# EAGLE design KLine_bottom_board (EAGLE 6.1)
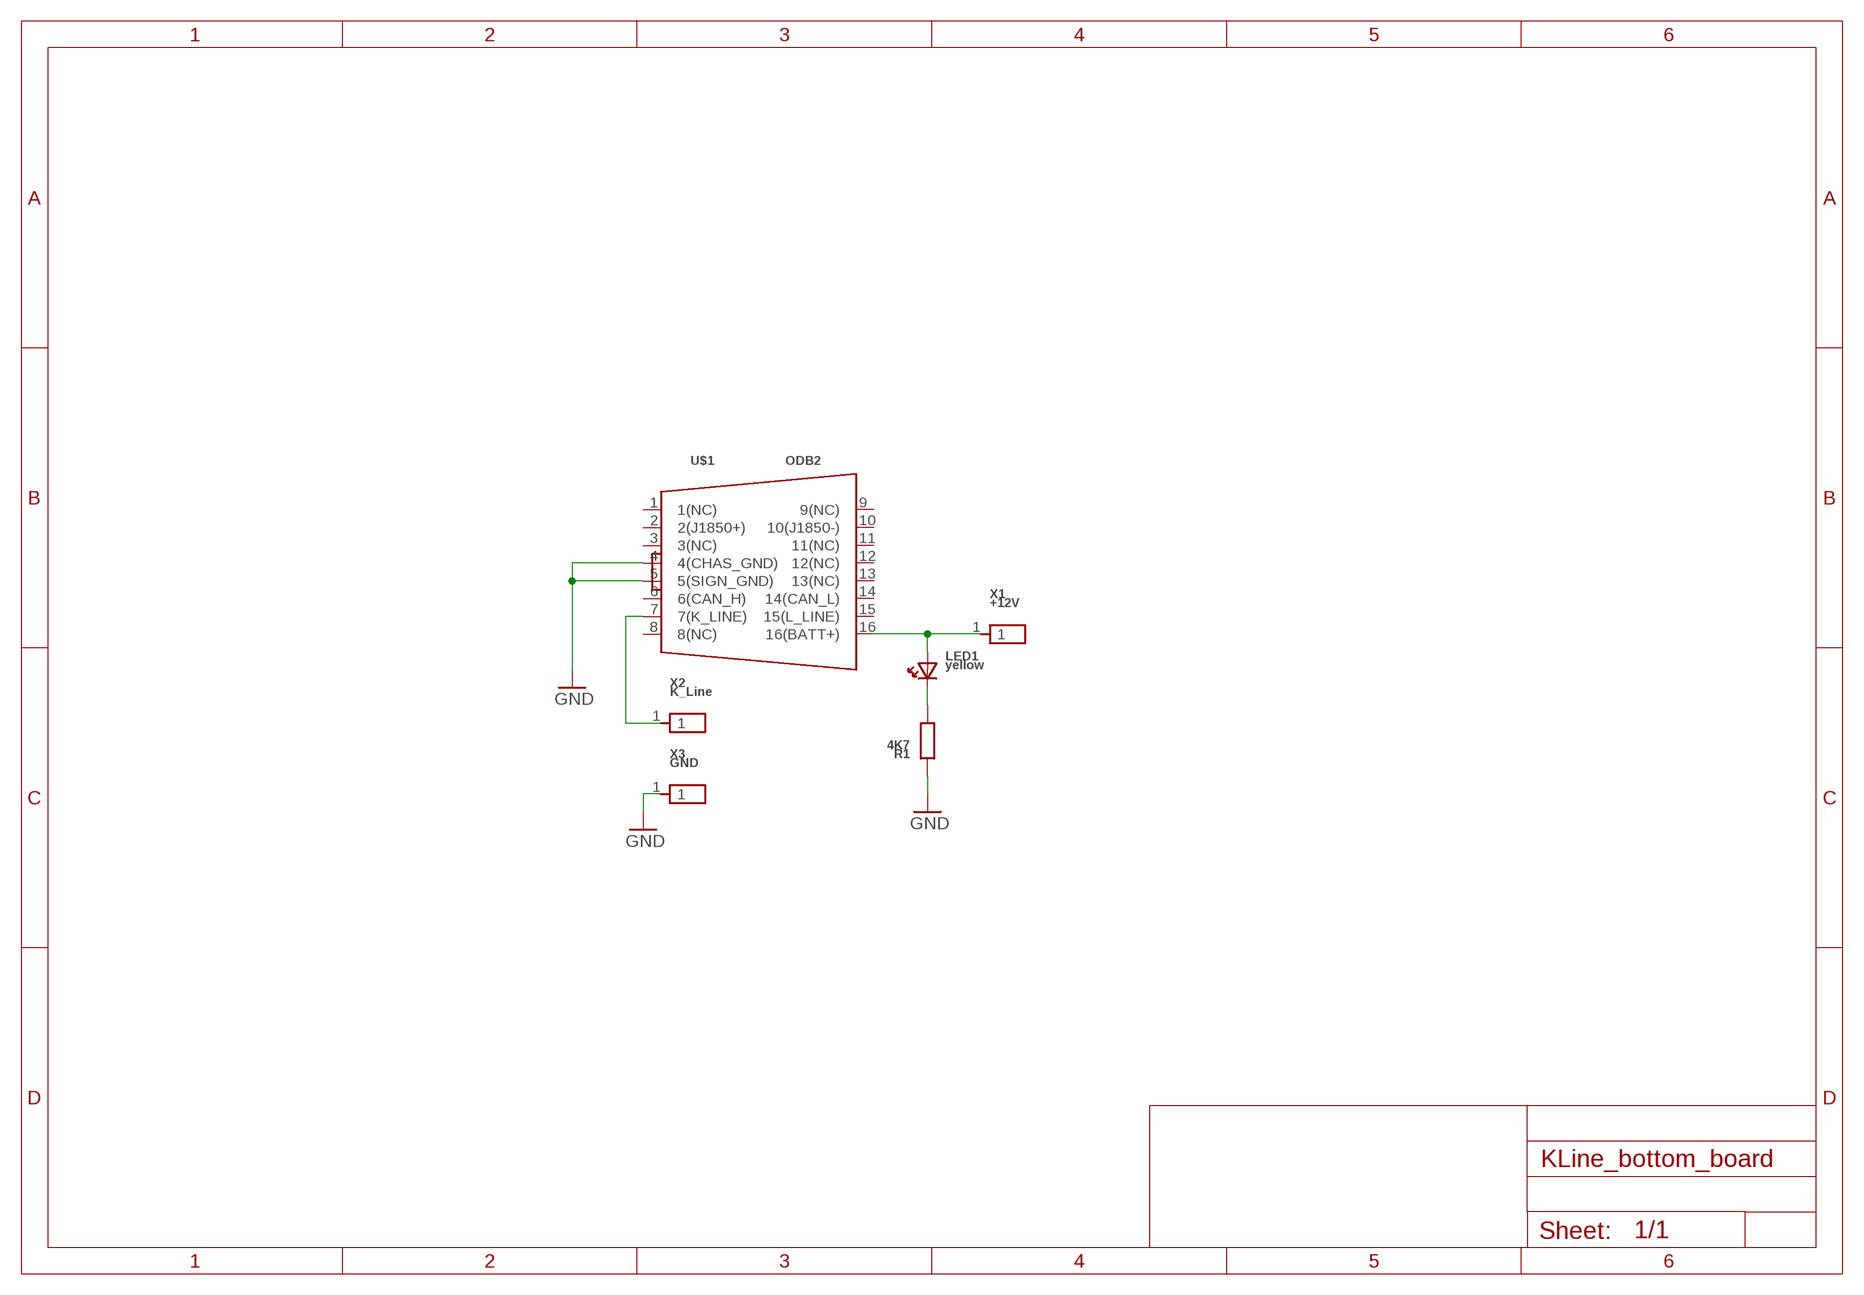
[diagram p0: schematic, sheet 1]

## Parts
LED1  yellow  LED3MM(SMD0805)  [LED_0805]
R1  4K7  RSMD_0805  [RSMD_0805]
U$1  ODB2  [ODB2]
X1  +12V  PIN1X13.5MM_SIDE_BOARD  [PIN1X1_3.5MM_SIDE_BOARD]
X2  K_Line  PIN1X13.5MM_SIDE_BOARD  [PIN1X1_3.5MM_SIDE_BOARD]
X3  GND  PIN1X13.5MM_SIDE_BOARD  [PIN1X1_3.5MM_SIDE_BOARD]

## Nets
BAT_+12V: LED1.ANODE U$1.16(16(BATT+)) X1.1
GND: R1.PAD_1(PIN1) U$1.4(4(CHAS_GND)) U$1.5(5(SIGN_GND)) X3.1
N$2: U$1.7(7(K_LINE)) X2.1
N$3: LED1.CATHODE R1.PAD_0(PIN0)
Unconnected: U$1.1(1(NC)) U$1.2(2(J1850+)) U$1.3(3(NC)) U$1.6(6(CAN_H)) U$1.8(8(NC)) U$1.9(9(NC)) U$1.10(10(J1850-)) U$1.11(11(NC)) U$1.12(12(NC)) U$1.13(13(NC)) U$1.14(14(CAN_L)) U$1.15(15(L_LINE))

## Library data of the parts
LED1 = __MyCommonLib1:LED3MM
R1 = __MyCommonLib1:R
U$1 = __MyCommonLib1:ODB2
X1-X3 = __MyCommonLib1:PIN1X1

## Board
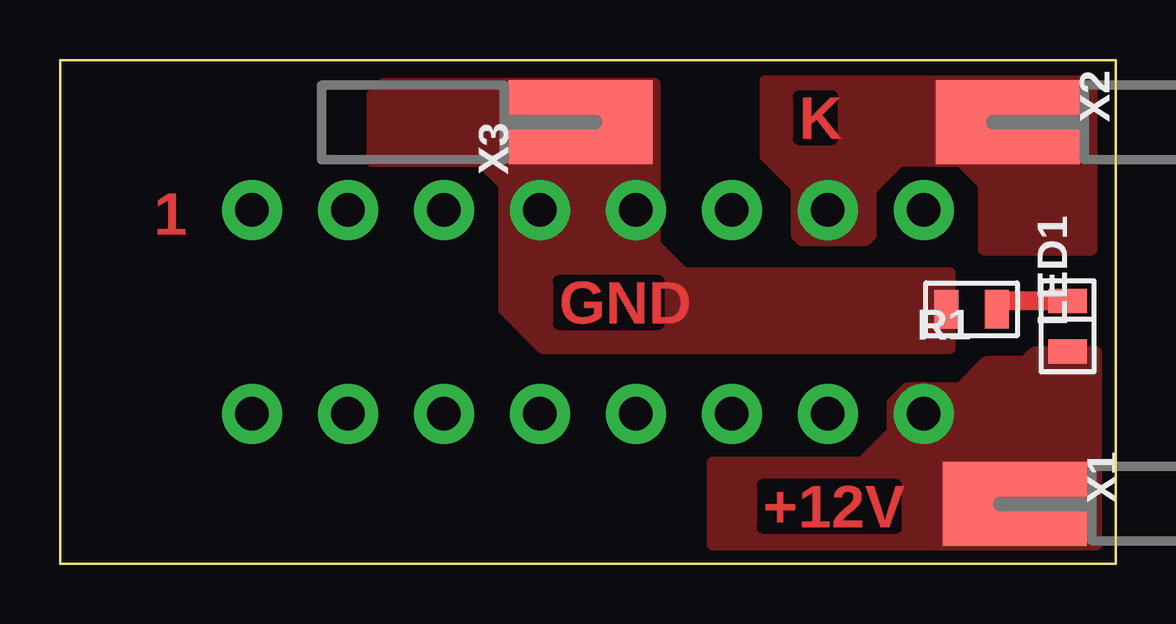
[diagram p1: board, top side]
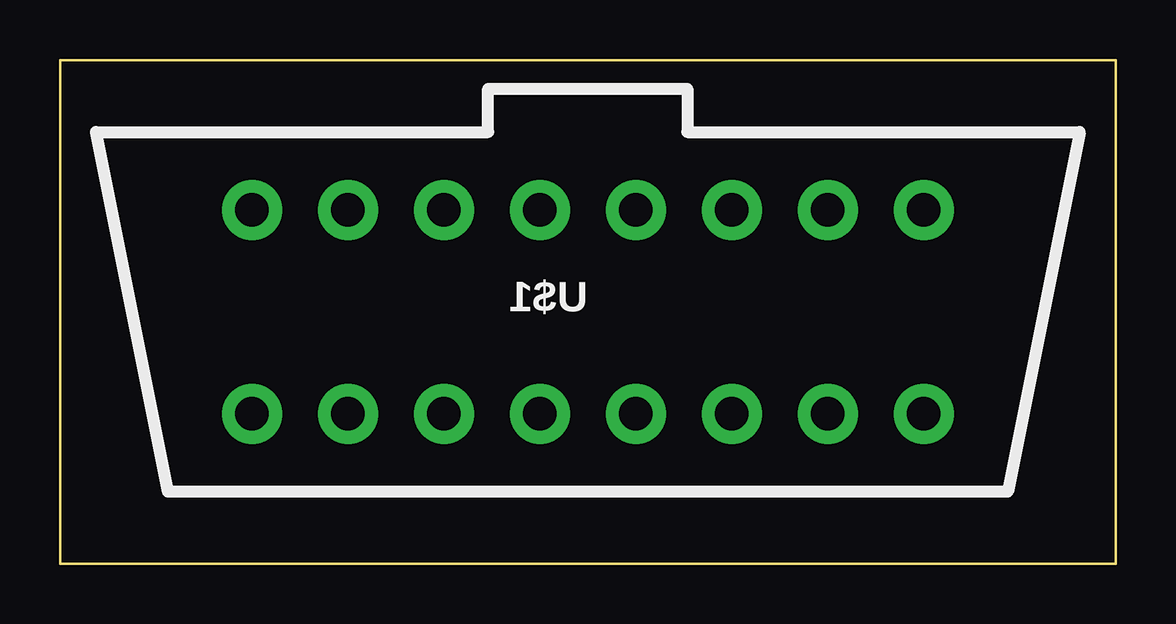
[diagram p2: board, bottom side, seen from below]

Size 44 x 21 mm. Coordinates in mm from the lower left corner, seen from the top.
Outline: 0,0 0,21 44,21 44,0 0,0
Copper layers (1*16): Top 0.035mm / dielectric 1.5mm / Bottom 0.035mm
Design rules: minimum track width 0.35mm, minimum drill 0.6mm, track to track 0.25mm, track to pad 0.25mm, pad to pad 0.25mm, via to via 0.25mm, smd to smd 0mil, copper to edge 0.2mm, drill to drill 8mil, minimum pad ring 10mil, minimum via ring 8mil, stop-mask expansion 4mil, vias tented up to drill 0mil, thermal gap 10mil

### Footprints (pad centres in the part's own frame; a part is rotated, then mirrored left to right if it is on the bottom)
LED_0805 = smd 1 x 1.6: ANODE -1.05,0; CATHODE 1.05,0
RSMD_0805 = smd 1 x 1.6: PAD_0 -1.05,0; PAD_1 1.05,0
ODB2 = drill 1.4 pad 2.5: 1 -14,4.25; 2 -10,4.25; 3 -6,4.25; 4 -2,4.25; 5 2,4.25; 6 6,4.25; 7 10,4.25; 8 14,4.25; 9 -14,-4.25; 10 -10,-4.25; 11 -6,-4.25; 12 -2,-4.25; 13 2,-4.25; 14 6,-4.25; 15 10,-4.25; 16 14,-4.25
PIN1X1_3.5MM_SIDE_BOARD = smd 3.5 x 6: 1 0,3

### Placement (x,y rotation side)
LED1  42,9.9 90 top
R1  38,10.6 180 top
U$1  22,10.5 0 top
X1  42.8,2.5 90 top
X2  42.5,18.4 90 top
X3  18.7,18.4 270 top

### Tracks (layer width: path | path; a pad name or v marks a point on that pad's centre or on a via)
BAT_+12V
  pour Top (no thermals): 27.2,0.8 43.2,0.8 43.2,8.8 40.6,8.8 40.2,8.4 38.6,8.4 37.5,7.3 35.3,7.3 34.7,6.7 34.7,5.5 33.4,4.2 27.2,4.2
GND
  pour Top (no thermals): 24.8,20 13.5,20 13,19.5 13,16.8 17.5,16.8 18.5,15.8 18.5,10.6 20.1,9 37.1,9 37.1,12.1 26,12.1 24.8,13.3
N$2
  pour Top (no thermals): 29.4,20.1 29.4,17 30.7,15.7 30.7,13.7 30.9,13.5 33.6,13.5 33.8,13.7 33.8,15.6 35,16.8 37.5,16.8 38.5,15.8 38.5,13.1 43,13.1 43,20.1
N$3
  Top 0.8: LED1.CATHODE 39.05,10.95 R1.PAD_0

### Text on the board
Top: K | 1 | GND | +12V